# Altium schematic sheet MCU.SchDoc
size A4
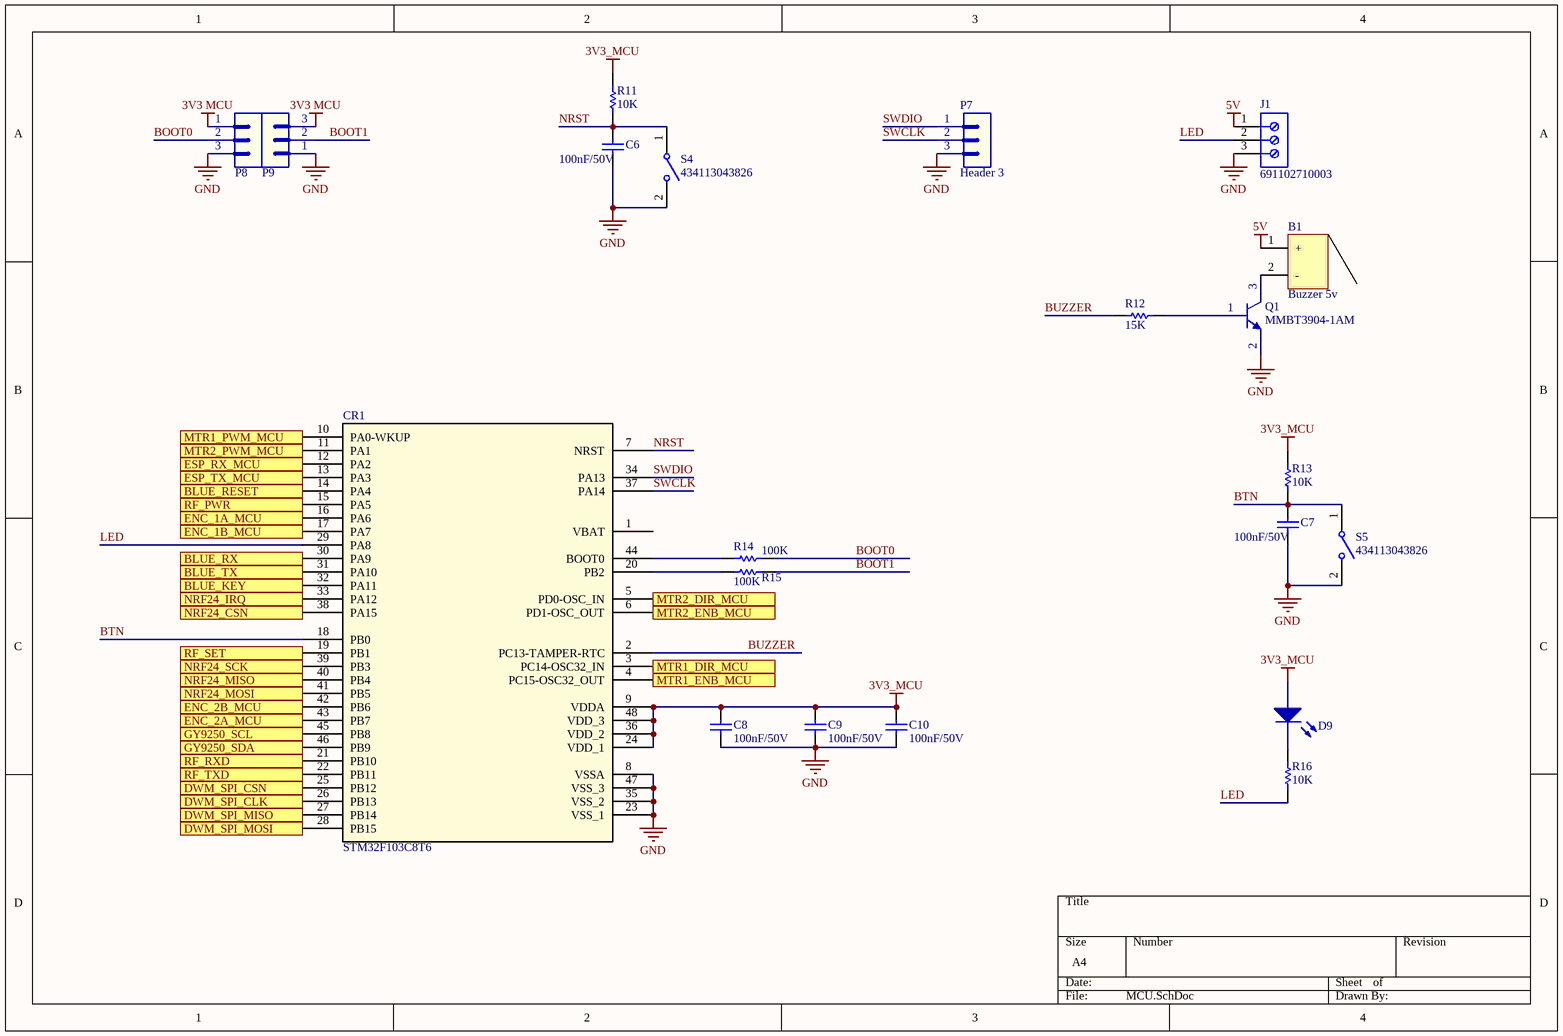
[diagram p0: MCU.SchDoc]

## Parts
B1  Buzzer 5v  [Buzzer 5v]
C6  value 100nF/50V  [CAP-SM-0805]  (hidden comment: Cap-1nF-50V-0805)
C7  value 100nF/50V  [CAP-SM-0805]  (hidden comment: Cap-1nF-50V-0805)
C8  value 100nF/50V  [CAP-SM-0805]  (hidden comment: Cap-1nF-50V-0805)
C9  value 100nF/50V  [CAP-SM-0805]  (hidden comment: Cap-1nF-50V-0805)
C10  value 100nF/50V  [CAP-SM-0805]  (hidden comment: Cap-1nF-50V-0805)
CR1  STM32F103C8T6  [STM32F103C8T6]
D9  LED  [LED_0603_Blue]  (value not drawn)
J1  691102710003  [691102710003]
P7  Header 3  [jp3]
P8  (no value)  [jp3]
P9  (no value)  [jp3]
Q1  MMBT3904-1AM  [SOT23_NEX]
R11  value 10K  [RES-SM-0805]  (hidden comment: Res-0-0805)
R12  value 15K  [RES-SM-0805]  (hidden comment: Res-12K-0805)
R13  value 10K  [RES-SM-0805]  (hidden comment: Res-0-0805)
R14  value 100K  [RES-SM-0805]  (hidden comment: Res-1K-0805)
R15  value 100K  [RES-SM-0805]  (hidden comment: Res-1K-0805)
R16  value 10K  [RES-SM-0805]  (hidden comment: Res-0-0805)
S4  434113043826  [434113043826]
S5  434113043826  [434113043826]

## Ports
BLUE_KEY (out), BLUE_RESET (out), BLUE_RX (out), BLUE_TX (in), DWM_SPI_CLK (out), DWM_SPI_CSN (out), DWM_SPI_MISO (in), DWM_SPI_MOSI (out), ENC_1A_MCU (in), ENC_1B_MCU (in), ENC_2A_MCU (in), ENC_2B_MCU (in), ESP_RX_MCU (out), ESP_TX_MCU (in), GY9250_SCL (out), GY9250_SDA (out), MTR1_DIR_MCU (out), MTR1_ENB_MCU (out), MTR1_PWM_MCU (out), MTR2_DIR_MCU (out), MTR2_ENB_MCU (out), MTR2_PWM_MCU (out), NRF24_CSN (out), NRF24_IRQ (in), NRF24_MISO (in), NRF24_MOSI (out), NRF24_SCK (out), RF_PWR (out), RF_RXD (out), RF_SET (out), RF_TXD (in)

## Nets
3V3 MCU: P8.1 P9.3
3V3_MCU: C8.2 C9.2 C10.2 CR1.9(VDDA) CR1.24(VDD_1) CR1.36(VDD_2) CR1.48(VDD_3) D9.1(A) R11.2 R13.2
5V: B1.1(+) J1.1
GND: C6.1 C7.1 C8.1 C9.1 C10.1 CR1.8(VSSA) CR1.23(VSS_1) CR1.35(VSS_2) CR1.47(VSS_3) J1.3 P7.3 P8.3 P9.1 Q1.2(E) S4.2 S5.2
BLUE_KEY: CR1.32(PA11) ; port BLUE_KEY
BLUE_RESET: CR1.14(PA4) ; port BLUE_RESET
BLUE_RX: CR1.30(PA9) ; port BLUE_RX
BLUE_TX: CR1.31(PA10) ; port BLUE_TX
BOOT0: P8.2 R14.2
BOOT1: P9.2 R15.2
BTN: C7.2 CR1.18(PB0) R13.1 S5.1
BUZZER: CR1.2(PC13-TAMPER-RTC) R12.1
DWM_SPI_CLK: CR1.26(PB13) ; port DWM_SPI_CLK
DWM_SPI_CSN: CR1.25(PB12) ; port DWM_SPI_CSN
DWM_SPI_MISO: CR1.27(PB14) ; port DWM_SPI_MISO
DWM_SPI_MOSI: CR1.28(PB15) ; port DWM_SPI_MOSI
ENC_1A_MCU: CR1.16(PA6) ; port ENC_1A_MCU
ENC_1B_MCU: CR1.17(PA7) ; port ENC_1B_MCU
ENC_2A_MCU: CR1.43(PB7) ; port ENC_2A_MCU
ENC_2B_MCU: CR1.42(PB6) ; port ENC_2B_MCU
ESP_RX_MCU: CR1.12(PA2) ; port ESP_RX_MCU
ESP_TX_MCU: CR1.13(PA3) ; port ESP_TX_MCU
GY9250_SCL: CR1.45(PB8) ; port GY9250_SCL
GY9250_SDA: CR1.46(PB9) ; port GY9250_SDA
LED: CR1.29(PA8) J1.2 R16.1
MTR1_DIR_MCU: CR1.3(PC14-OSC32_IN) ; port MTR1_DIR_MCU
MTR1_ENB_MCU: CR1.4(PC15-OSC32_OUT) ; port MTR1_ENB_MCU
MTR1_PWM_MCU: CR1.10(PA0-WKUP) ; port MTR1_PWM_MCU
MTR2_DIR_MCU: CR1.5(PD0-OSC_IN) ; port MTR2_DIR_MCU
MTR2_ENB_MCU: CR1.6(PD1-OSC_OUT) ; port MTR2_ENB_MCU
MTR2_PWM_MCU: CR1.11(PA1) ; port MTR2_PWM_MCU
NRF24_CSN: CR1.38(PA15) ; port NRF24_CSN
NRF24_IRQ: CR1.33(PA12) ; port NRF24_IRQ
NRF24_MISO: CR1.40(PB4) ; port NRF24_MISO
NRF24_MOSI: CR1.41(PB5) ; port NRF24_MOSI
NRF24_SCK: CR1.39(PB3) ; port NRF24_SCK
NRST: C6.2 CR1.7(NRST) R11.1 S4.1
RF_PWR: CR1.15(PA5) ; port RF_PWR
RF_RXD: CR1.21(PB10) ; port RF_RXD
RF_SET: CR1.19(PB1) ; port RF_SET
RF_TXD: CR1.22(PB11) ; port RF_TXD
SWCLK: CR1.37(PA14) P7.2
SWDIO: CR1.34(PA13) P7.1
NetB1_2: B1.2(-) Q1.3(C)
NetCR1_20: CR1.20(PB2) R15.1
NetCR1_44: CR1.44(BOOT0) R14.1
NetD9_2: D9.2(K) R16.2
NetQ1_1: Q1.1(B) R12.2

Not connected (* = marked no-connect by the designer): CR1 1(VBAT)

## Library data of the parts
C6-C10 = Cap-1nF-50V-0805: CAP CER 1000PF 100V X7R 0805; Manufacturer: Johanson Dielectrics Inc.; Manufacturer Part Number: 101X15W102MV4E; Local Supplier: thegioiic; Local Supplier Link: https://thegioiic.com/products/tu-1nf-50v-0805; Supplier 1: Digikey; Supplier 1 Link: https://www.digikey.com/product-detail/en/johanson-dielectrics-inc/101X15W102MV4E/709-1335-1-ND/2327235; Supplier 1 Part Number: 709-1335-1-ND
CR1 = STM32F103C8T6: SourceLibrary: StMicro_2011-06-07; Built_By: EMA_UL_Team; Vendor: STMicroelectronics; Type: DEV; Manufacturer_Part_Number: STM32F103C8T6; Copyright: Copyright (C) 2018 Accelerated Designs. All rights reserved; RefDes: RefDes
J1 = 691102710003: WR-TBL Serie 102 Horizontal Entry Modular, Pressure Clamp, pitch 5mm, 3p; Compliance: Lead free / RoHS; Modularity: Yes; PCB/Cable/Panel: PCB; Pin Number: 3; Rated Current [UL]: 15A; Working Voltage [UL]: 250VAC; ComponentLink1Description: Manufacturer; ComponentLink1URL: http://www.we-online.de; ComponentLink2URL: https://katalog.we-online.de/em/datasheet/691102710003.pdf; ComponentLink2Description: Datasheet; Mounting Technology: THT; Part Number: 691102710003; Packaging: Box; Operating Temperature: -40 to +105degC; Pitch: 5mm; Published Date: October 2019; Type: Horizontal; Publisher: Wurth Elektronik; Application: Pressure Clamp
P7-P9 = Header 3: Header, 3-Pin; LatestRevisionDate: 17-Jul-2002; LatestRevisionNote: Re-released for DXP Platform.; Publisher: Altium Limited
R11 R13 R16 = Res-0-0805: RES 0 OHM JUMPER 0805; Manufacturer: Vishay Dale; Manufacturer Part Number: WSL080500000ZEA9; Local Supplier: thegioiic; Local Supplier Link: https://thegioiic.com/products/dien-tro-0-ohm-0805-5; Supplier 1: Digikey; Supplier 1 Link: https://www.digikey.com/product-detail/en/vishay-dale/WSL080500000ZEA9/541-3928-1-ND/7423223; Supplier 1 Part Number: 541-3928-1-ND
R12 = Res-12K-0805: RES 12 KOHM JUMPER 0805; Manufacturer: Vishay Thin Film; Manufacturer Part Number: PAT0805E3121BST1; Local Supplier: icdayroi; Local Supplier Link: https://icdayroi.com/dien-tro-12k-0805-1-goi-50-con; Supplier 1: Digikey; Supplier 1 Link: https://www.digikey.com/product-detail/en/vishay-thin-film/PAT0805E3121BST1/PAT0805E3121BST1-ND/2281536; Supplier 1 Part Number: PAT0805E3121BST1-ND
R14 R15 = Res-1K-0805: RES 1K OHM 1% 1/4W 0805; Manufacturer: Stackpole Electronics Inc; Manufacturer Part Number: RNCP0805FTD1K00; Local Supplier: thegioiic; Local Supplier Link: https://thegioiic.com/products/dien-tro-1k-ohm-0805-5; Supplier 1: Digikey; Supplier 1 Link: https://www.digikey.com/product-detail/en/stackpole-electronics-inc/RNCP0805FTD1K00/RNCP0805FTD1K00CT-ND/2240568; Supplier 1 Part Number: RNCP0805FTD1K00CT-ND
S4 S5 = 434113043826: WS-TASV J-Bend SMT Tact Switch 6x3.5mm, height 4.3mm, 260gf; Rated Voltage: 12VDC; Rated Current: 50mA; Washable: No; ComponentLink1Description: Manufacturer; ComponentLink1URL: http://www.we-online.de; ComponentLink2Description: Datasheet; ComponentLink2URL: https://katalog.we-online.com/em/datasheet/434113043826.pdf; Operating Temperature: -40 to +85degC; Part Number: 434113043826; Published Date: September 2019; Contact Material: Stainless Steel; Height: 4.3mm; Mounting Technology: SMT; Contact Plating: Silver; Operation Force: 260gf; Packaging: Tape and Reel; Terminal Material: Copper Alloy; Publisher: Wurth Elektronik; Terminal Plating: Silver